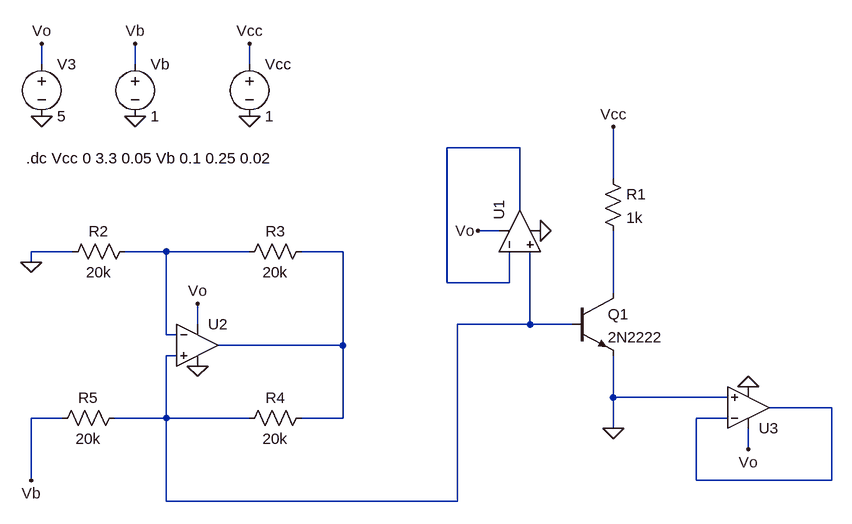
[diagram p0: schematic BJT_Curve_Tracker_v1.asc]
BJT_Curve_Tracker_v1.asc, the LTspice schematic file:
Version 4.1
SHEET 1 880 680
WIRE -640 -112 -640 -144
WIRE -496 -112 -496 -144
WIRE -320 -112 -320 -144
WIRE 96 16 -16 16
WIRE 240 64 240 -16
WIRE 96 112 96 16
WIRE 64 144 32 144
WIRE -592 176 -656 176
WIRE -448 176 -512 176
WIRE -320 176 -448 176
WIRE -176 176 -240 176
WIRE -656 192 -656 176
WIRE -16 224 -16 16
WIRE 80 224 80 176
WIRE 80 224 -16 224
WIRE 240 240 240 144
WIRE -400 288 -400 256
WIRE 112 288 112 176
WIRE 112 288 0 288
WIRE 176 288 112 288
WIRE -448 304 -448 176
WIRE -432 304 -448 304
WIRE -176 320 -176 176
WIRE -176 320 -368 320
WIRE -432 336 -448 336
WIRE 240 400 240 336
WIRE 416 400 240 400
WIRE 576 416 480 416
WIRE -608 432 -656 432
WIRE -448 432 -448 336
WIRE -448 432 -528 432
WIRE -320 432 -448 432
WIRE -176 432 -176 320
WIRE -176 432 -240 432
WIRE 416 432 368 432
WIRE 240 448 240 400
WIRE 448 480 448 448
WIRE -656 528 -656 432
WIRE 368 528 368 432
WIRE 576 528 576 416
WIRE 576 528 368 528
WIRE -448 560 -448 432
WIRE 0 560 0 288
WIRE 0 560 -448 560
FLAG -320 -32 0
FLAG -320 -144 Vcc
FLAG 240 448 0
FLAG -656 192 0
FLAG -496 -32 0
FLAG -496 -144 Vb
FLAG -656 528 Vb
FLAG 240 -16 Vcc
FLAG 128 144 0
FLAG -640 -32 0
FLAG -640 -144 Vo
FLAG 32 144 Vo
FLAG 448 384 0
FLAG 448 480 Vo
FLAG -400 352 0
FLAG -400 256 Vo
SYMBOL OpAmps\\UniversalOpAmp2 96 144 R270
SYMATTR InstName U1
SYMBOL voltage -320 -128 R0
WINDOW 123 0 0 Left 0
WINDOW 39 0 0 Left 0
SYMATTR InstName Vcc
SYMATTR Value 1
SYMBOL npn 176 240 R0
SYMATTR InstName Q1
SYMATTR Value 2N2222
SYMBOL res 224 48 R0
SYMATTR InstName R1
SYMATTR Value 1k
SYMBOL OpAmps\\UniversalOpAmp2 -400 320 R0
SYMATTR InstName U2
SYMBOL res -496 160 R90
WINDOW 0 0 56 VBottom 2
WINDOW 3 32 56 VTop 2
SYMATTR InstName R2
SYMATTR Value 20k
SYMBOL res -224 160 R90
WINDOW 0 0 56 VBottom 2
WINDOW 3 32 56 VTop 2
SYMATTR InstName R3
SYMATTR Value 20k
SYMBOL res -224 416 R90
WINDOW 0 0 56 VBottom 2
WINDOW 3 32 56 VTop 2
SYMATTR InstName R4
SYMATTR Value 20k
SYMBOL res -512 416 R90
WINDOW 0 0 56 VBottom 2
WINDOW 3 32 56 VTop 2
SYMATTR InstName R5
SYMATTR Value 20k
SYMBOL voltage -496 -128 R0
WINDOW 123 0 0 Left 0
WINDOW 39 0 0 Left 0
SYMATTR InstName Vb
SYMATTR Value 1
SYMBOL voltage -640 -128 R0
WINDOW 123 0 0 Left 0
WINDOW 39 0 0 Left 0
SYMATTR InstName V3
SYMATTR Value 5
SYMBOL OpAmps\\UniversalOpAmp2 448 416 M180
SYMATTR InstName U3
TEXT -664 32 Left 2 !.dc Vcc 0 3.3 0.05 Vb 0.1 0.25 0.02

The netlist it stands for:
* BJT_Curve_Tracker_v1.asc
X§U1 N005 N001 Vo 0 N001 level2 Avol=1Meg GBW=10Meg Slew=10Meg Ilimit=25m Rail=0 Vos=0 En=0 Enk=0 In=0 Ink=0 Rin=500Meg  ; pins In+ In- V+ V- OUT
Vcc Vcc 0 1
Q1 N004 N005 0 0 2N2222
R1 Vcc N004 1k
X§U2 N005 N002 Vo 0 N003 level2 Avol=1Meg GBW=10Meg Slew=10Meg Ilimit=25m Rail=0 Vos=0 En=0 Enk=0 In=0 Ink=0 Rin=500Meg  ; pins In+ In- V+ V- OUT
R2 N002 0 20k
R3 N003 N002 20k
R4 N003 N005 20k
R5 N005 Vb 20k
Vb Vb 0 1
V3 Vo 0 5
X§U3 0 N006 Vo 0 N006 level2 Avol=1Meg GBW=10Meg Slew=10Meg Ilimit=25m Rail=0 Vos=0 En=0 Enk=0 In=0 Ink=0 Rin=500Meg  ; pins In+ In- V+ V- OUT
.model NPN NPN
.model PNP PNP
.lib standard.bjt
.dc Vcc 0 3.3 0.05 Vb 0.1 0.25 0.02
.lib UniversalOpAmp2.lib
.backanno
.end